# EAGLE design bpf-L-band-BP0805 (EAGLE 9.2.2)
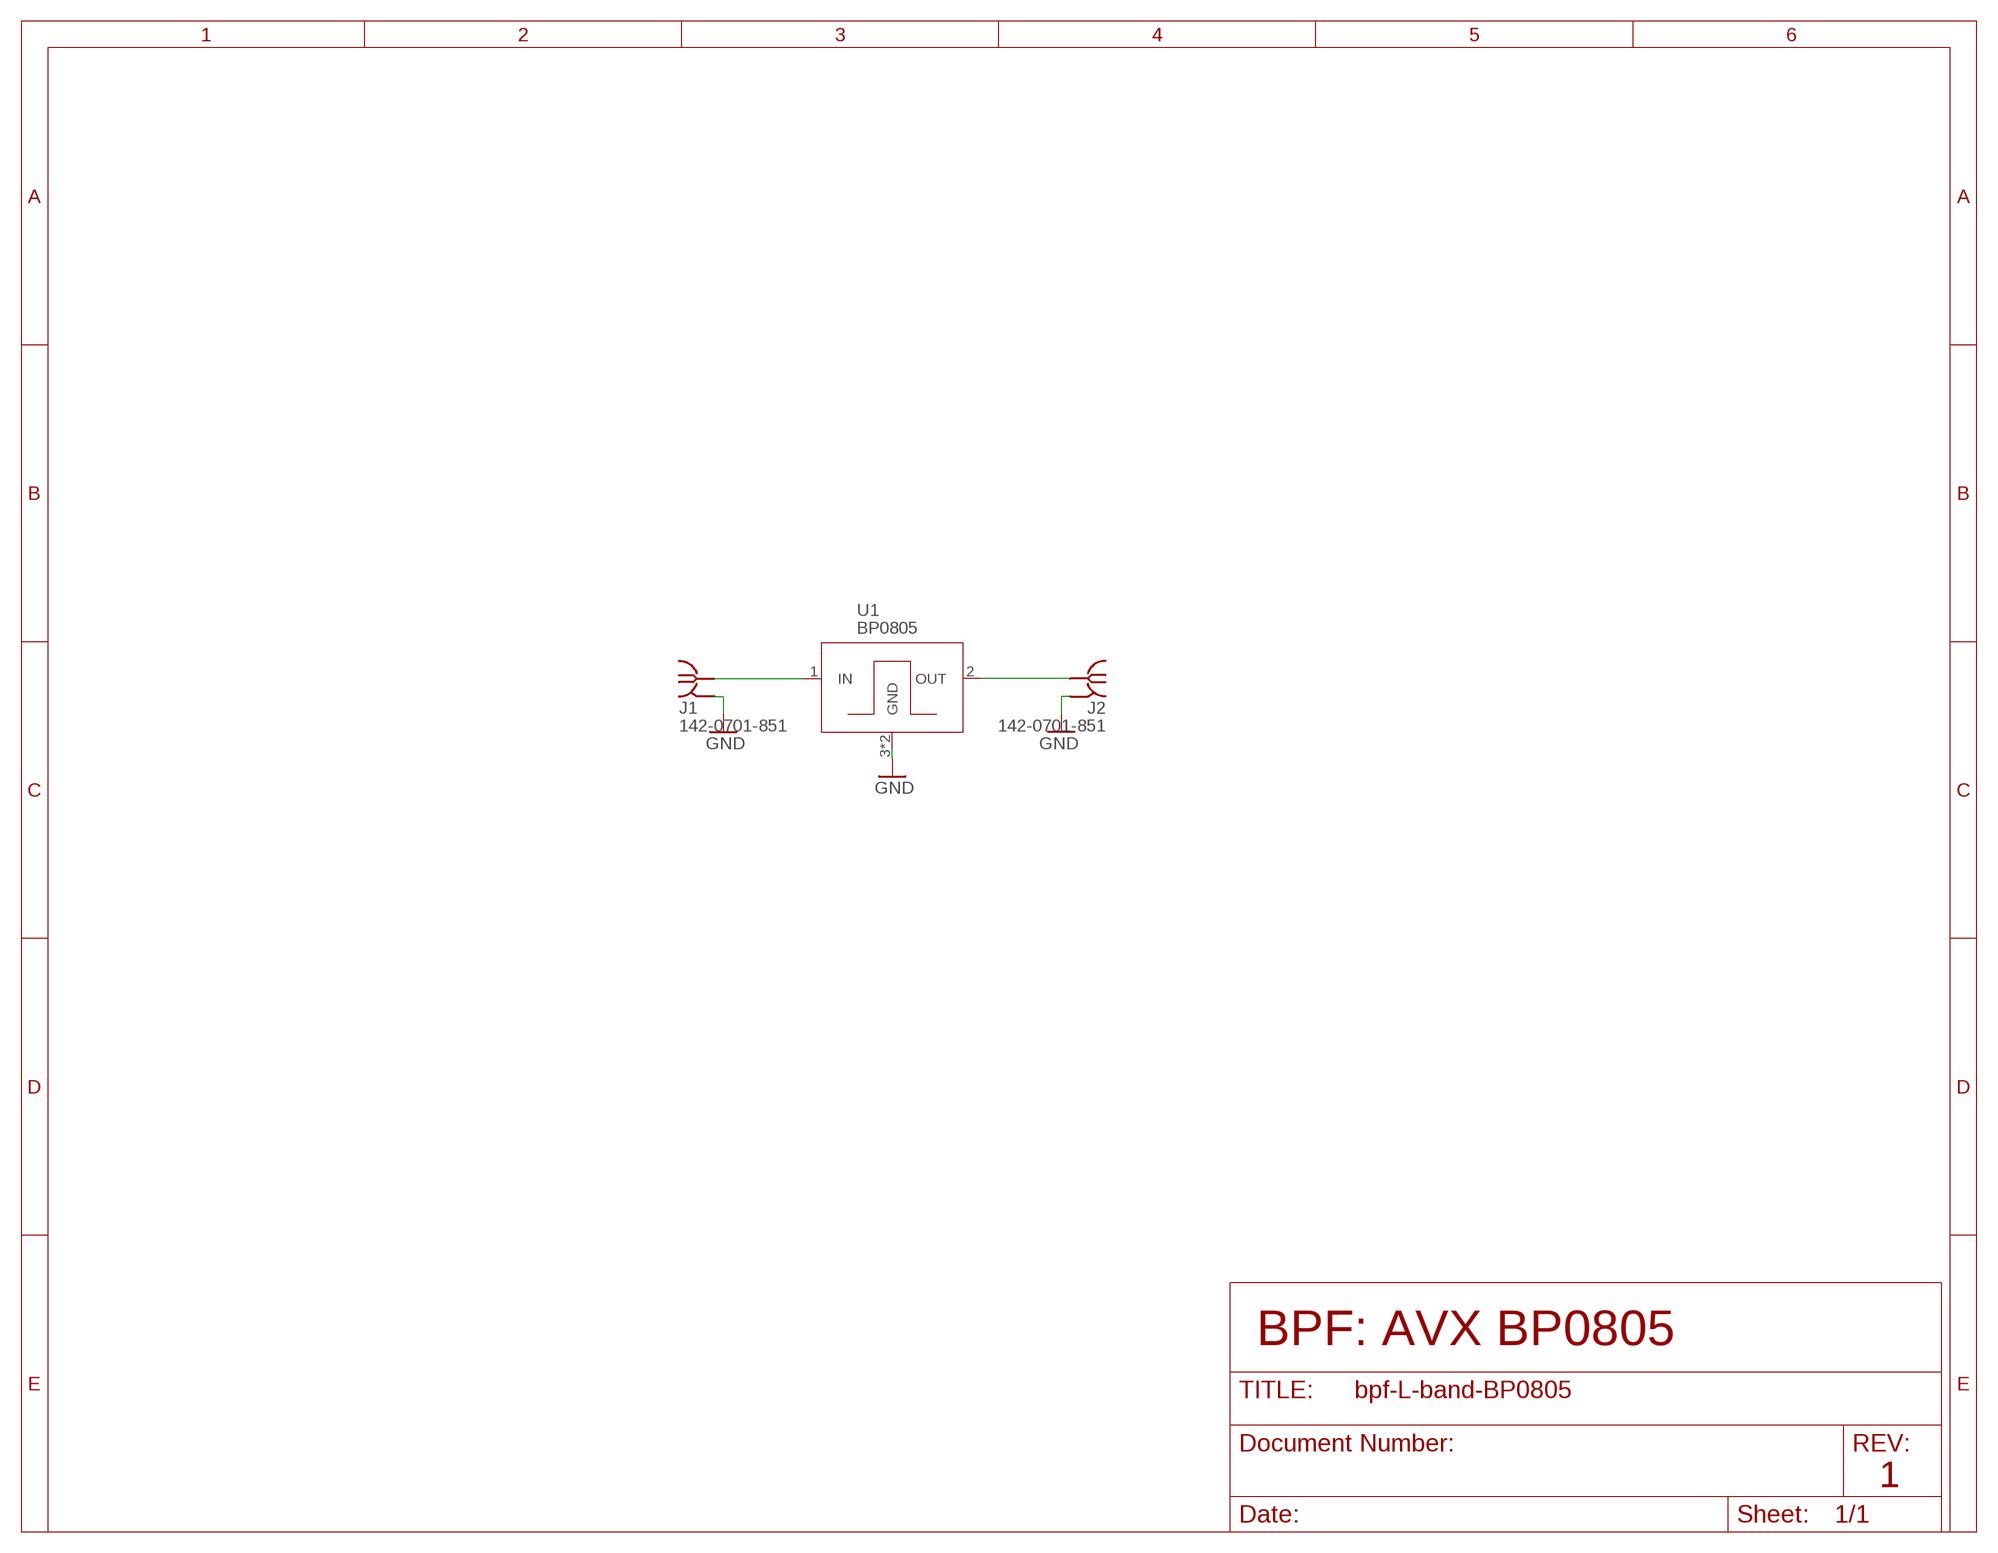
[diagram p0: schematic, sheet 1]

## Parts
J1  142-0701-851  [142-0701-851]
J2  142-0701-851  [142-0701-851]
U1  BP0805  [BP0805]

## Nets
GND: J1.GND1(GND) J1.GND2(GND) J1.GND3(GND) J1.GND4(GND) J2.GND1(GND) J2.GND2(GND) J2.GND3(GND) J2.GND4(GND) U1.3(GND) U1.4(GND)
RF-IN [RF]: J1.RF1(RF) U1.1(IN)
RF-OUT [RF]: J2.RF1(RF) U1.2(OUT)

## Notes on the sheet
- BPF: AVX BP0805
- 1

## Library data of the parts
J1 J2 = J-Cinch-142-0701-851-SMA-end-launch:142-0701-851: SMA Jack 50Ω - End Launch Source: Datasheet <https://belfuse.com/resources/productinformations/cinchconnectivitysolutions/johnson/pi-ccs-john-142-0701-851.pdf>
U1 = U-AVX-BP0805-BPF:BP0805

## Net classes
1 RF: clearance 0.7 mm

## Board
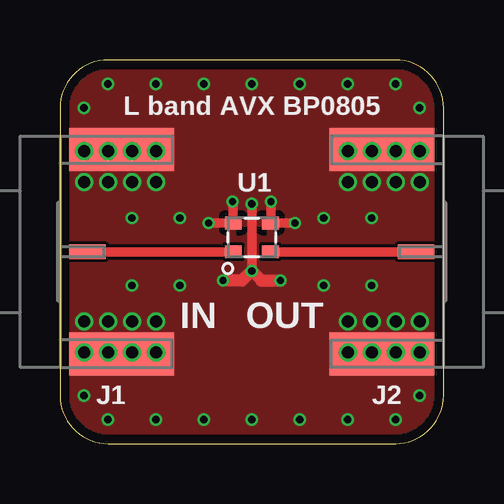
[diagram p1: board, top side]
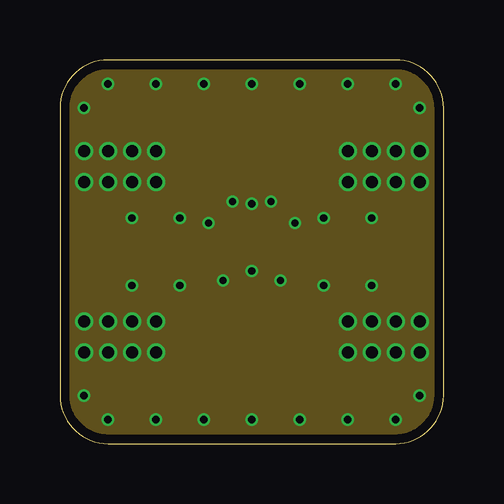
[diagram p2: board, inner layer Route2]
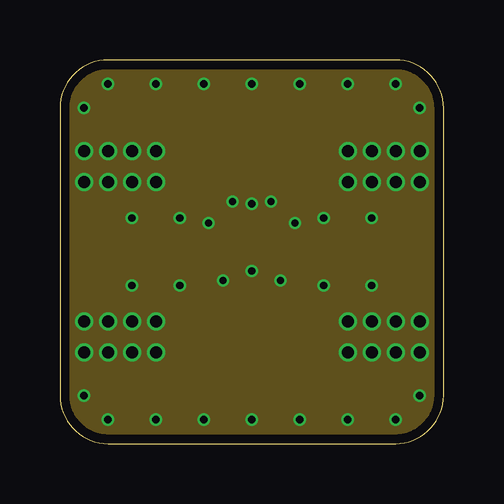
[diagram p3: board, inner layer Route15]
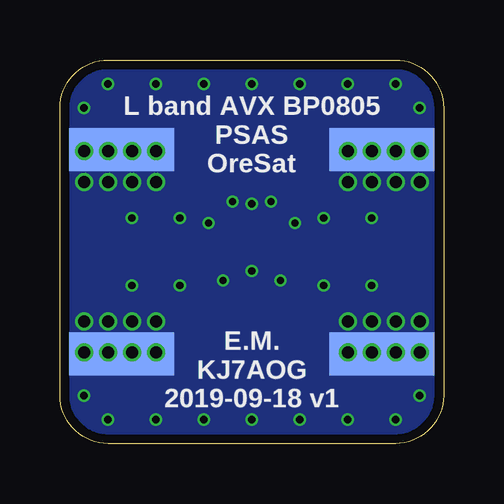
[diagram p4: board, bottom side, seen from below]

Size 16 x 16 mm. Coordinates in mm from the lower left corner, seen from the top.
Outline: 0,14 0,2 arc90 2,0 14,0 arc90 16,2 16,14 arc90 14,16 2,16 arc90 0,14
Copper layers (1*2*15*16): Top 0.035559375mm / dielectric 0.17018125mm / Route2 0.01778125mm / dielectric 47mil / Route15 0.01778125mm / dielectric 0.17018125mm / Bottom 0.035559375mm
Design rules "oshpark-4layer-tented": minimum track width 5mil, minimum drill 10mil, track to track 5mil, track to pad 5mil, pad to pad 5mil, via to via 5mil, smd to smd 5mil, copper to edge 15mil, drill to drill 6mil, minimum pad ring 4mil, minimum via ring 4mil, stop-mask expansion 2.5mil, vias tented up to drill 20mil, thermal gap 10mil

### Footprints (pad centres in the part's own frame; a part is rotated, then mirrored left to right if it is on the bottom)
142-0701-851 = smd 1.8 x 4.37: GND1 -4.255,-2.566; GND2 4.255,-2.566 | smd 1.8 x 4.37 bottom: GND3 -4.255,-2.566; GND4 4.255,-2.566 | smd 0.6 x 1.53: RF1 0,-1.146
BP0805 = smd 0.54 x 0.7: 1 -0.6,0.775; 2 -0.6,-0.775; 3 0.6,-0.775; 4 0.6,0.775

### Placement (x,y rotation side)
J1  0,8 90 top
J2  16,8 270 top
U1  8,8.6 90 top

### Tracks (layer width: path | path; a pad name or v marks a point on that pad's centre or on a via)
GND  (via drill 0.3, 0.5)
  Top 0.4: v6.2,9.2 U1.4 7.22,10.1 v7.2,10.1 | v9.8,9.2 U1.3 8.8,9.2 v8.8,10.1 | v8,10 v8,7.2
  Top 0.5: v6.8,6.8 7.6,6.8 v8,7.2 8.4,6.8 v9.2,6.8
  other vias: 1,12.2 2,12.2 3,12.2 4,12.2 1,10.9 2,10.9 3,10.9 4,10.9 1,3.8 2,3.8 3,3.8 4,3.8 4,5.1 3,5.1 2,5.1 1,5.1 12,3.8 13,3.8 14,3.8 15,3.8 15,5.1 14,5.1 13,5.1 12,5.1 12,12.2 13,12.2 14,12.2 15,12.2 12,10.9 13,10.9 14,10.9 15,10.9 3,6.6 5,6.6 13,6.6 11,6.6 3,9.4 5,9.4 13,9.4 11,9.4 1,2 2,1 14,1 15,2 4,1 6,1 8,1 10,1 12,1 1,14 2,15 4,15 6,15 8,15 10,15 12,15 14,15 15,14
  pour Top: 0,16 16,16 16,0 0,0
  pour Route2: 0,16 16,16 16,0 0,0
  pour Route15: 0,16 16,16 16,0 0,0
  pour Bottom: 0,16 16,16 16,0 0,0
  pour Top (no thermals): 0,14 5,14 5,2 0,2
  pour Top (no thermals): 11,14 16,14 16,2 11,2
  pour Bottom (no thermals): 0,14 5,14 5,2 0,2
  pour Bottom (no thermals): 11,14 16,14 16,2 11,2
RF-IN
  Top 0.39: J1.RF1 U1.1
RF-OUT
  Top 0.39: J2.RF1 U1.2

### Text on the board
tPlace: L band AVX BP0805 | IN | OUT
bPlace: L band AVX BP0805 / PSAS / OreSat | E.M. / KJ7AOG / 2019-09-18 v1